# Altium schematic sheet EFR32MG24_Minimum_BOM_REF_DES_A00_SCH.SchDoc
size 420 x 297 mm; SheetNumber: 2; SheetTotal: 2
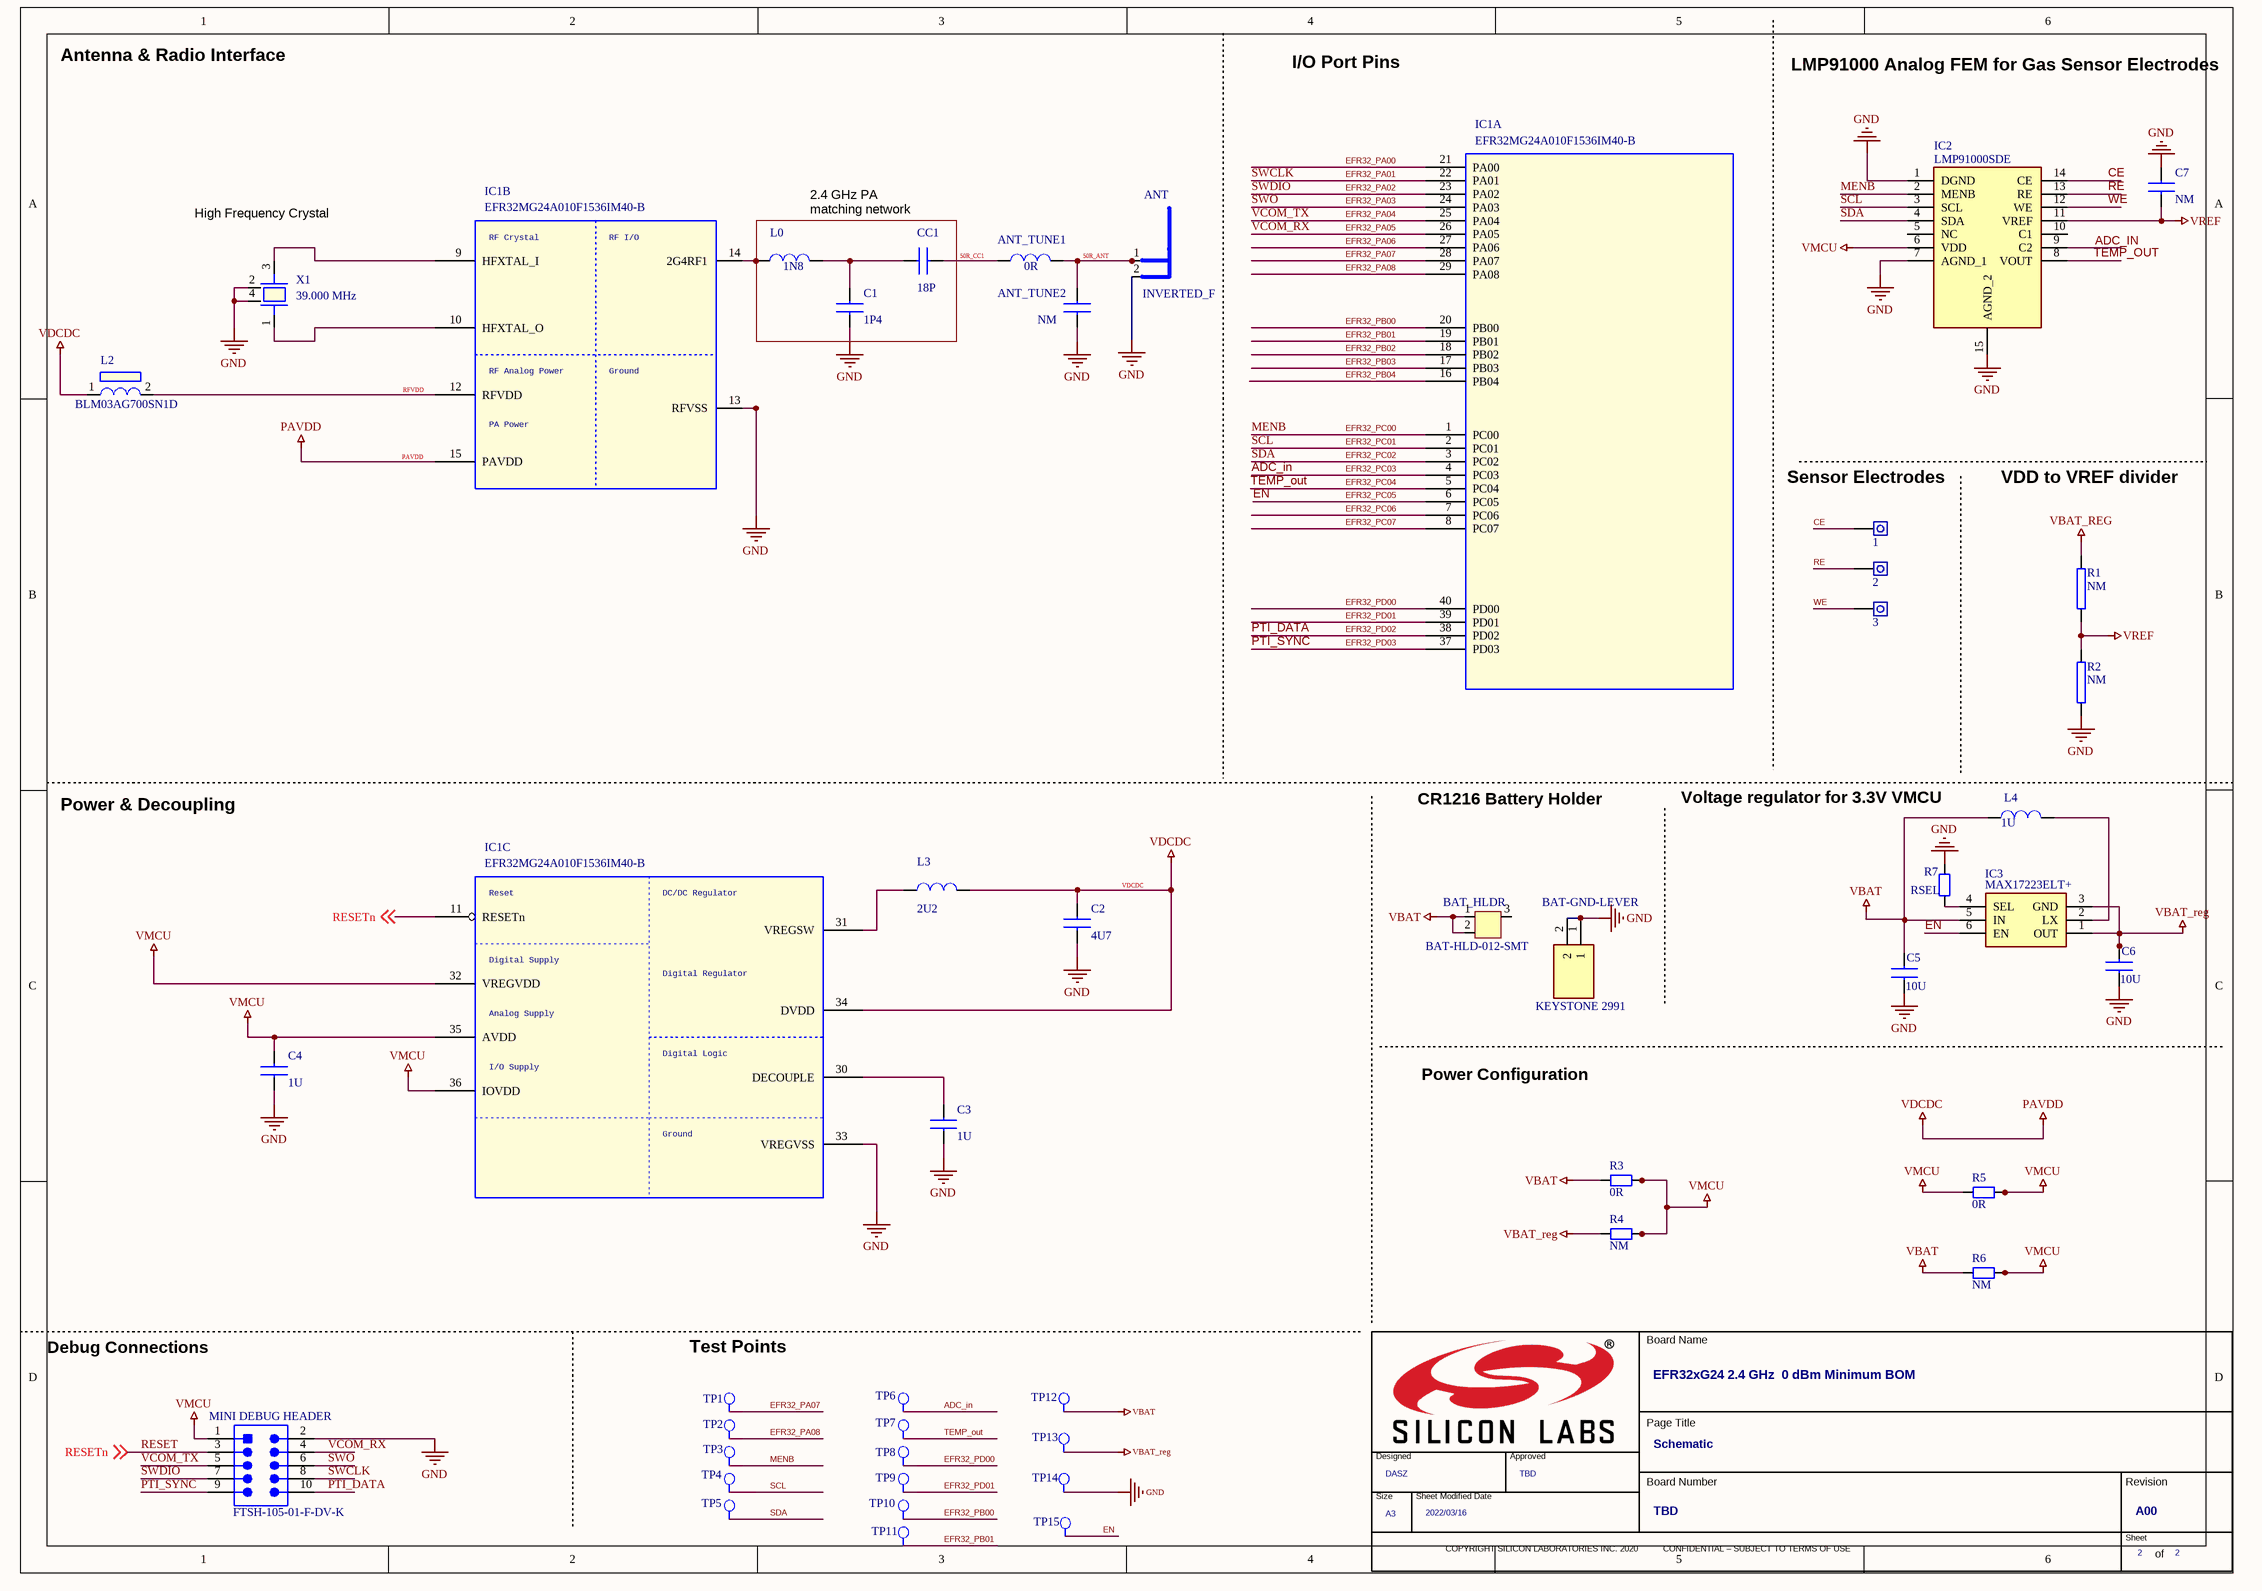
[diagram p0: EFR32MG24_Minimum_BOM_REF_DES_A00_SCH.SchDoc]

## Parts
1  Sensor Electrode  [Sensor Electrode]  (value not drawn)
2  Sensor Electrode  [Sensor Electrode]  (value not drawn)
3  Sensor Electrode  [Sensor Electrode]  (value not drawn)
*  Doc: TBD  RevCode: A00  Board Designer: DASZ  Page Title: Schematic  Page Size: A3  Page Number: 2  Title: EFR32xG24 2.4 GHz  0 dBm Minimum BOM  Page Modify Date: 2022/03/16  (hidden comment: TitleBlock_SiliconLabs_A3)  (graphical)
ANT  INVERTED_F  [ANT_MEANDERED_2445 - FABRICATION - cut]
ANT_TUNE1  0R  [COIL_0201_L]
ANT_TUNE2  NM  [C0201_L]
BAT-GND-LEVER  KEYSTONE 2991  [2991]
BAT_HLDR  BAT-HLD-012-SMT  [BATHLD012SMT]
C1  1P4  [C0201_L]
C2  4U7  [C0603_L]
C3  1U  [C0402_L]
C4  1U  [C0402_L]
C5  10U  [C0402_L]
C6  10U  [C0402_L]
C7  NM  [C0402_L]
CC1  18P  [C0201_L]
IC1  EFR32MG24A010F1536IM40-B  [QFN40_M040_5.0X5.0_EP_RP_SL]  (parts A,B,C of 3)
IC2  LMP91000SDE  [SON50P400X400X80-15N]
IC3  MAX17223ELT+  [MAX17223ELT]
L0  1N8  [COIL_0201_L]
L2  BLM03AG700SN1D  [COIL_MUR_BLM03_0201]
L3  2U2  [COIL_1008_L]
L4  1U  [C0603_L]
MINI_DEBUG_HEADER  FTSH-105-01-F-DV-K  [FTSH_105_01_L_DV_K]
R1  NM  [R0201_L]
R2  NM  [R0201_L]
R3  0R  [R0201_L]
R4  NM  [R0201_L]
R5  0R  [R0201_L]
R6  NM  [R0201_L]
R7  RSEL  [R0201_L]
TP1  TP  [TP_1.0_SMD]  (value not drawn)
TP2  TP  [TP_1.0_SMD]  (value not drawn)
TP3  TP  [TP_1.0_SMD]  (value not drawn)
TP4  TP  [TP_1.0_SMD]  (value not drawn)
TP5  TP  [TP_1.0_SMD]  (value not drawn)
TP6  TP  [TP_1.0_SMD]  (value not drawn)
TP7  TP  [TP_1.0_SMD]  (value not drawn)
TP8  TP  [TP_1.0_SMD]  (value not drawn)
TP9  TP  [TP_1.0_SMD]  (value not drawn)
TP10  TP  [TP_1.0_SMD]  (value not drawn)
TP11  TP  [TP_1.0_SMD]  (value not drawn)
TP12  TP  [TP_1.0_SMD]  (value not drawn)
TP13  TP  [TP_1.0_SMD]  (value not drawn)
TP14  TP  [TP_1.0_SMD]  (value not drawn)
TP15  TP  [TP_1.0_SMD]  (value not drawn)
X1  39.000 MHz  [X_SSS_DSX211SH_2.05X1.65-4]

## Nets
GND: ANT.2 ANT_TUNE2.2 BAT-GND-LEVER.1 BAT-GND-LEVER.2 C1.2 C2.2 C3.2 C4.2 C5.1 C6.1 C7.1 IC1.13(RFVSS) IC1.33(VREGVSS) IC2.1(DGND) IC2.7(AGND_1) IC2.15(AGND_2) MINI_DEBUG_HEADER.2 R2.1 R7.2 TP14.1(TP) X1.2 X1.4
PAVDD: C2.1 IC1.15(PAVDD) IC1.34(DVDD) L2.1 L3.2  [also labelled VDCDC]
VBAT: BAT_HLDR.1 BAT_HLDR.2 C5.2 IC3.5(IN) L4.1 R3.1 R6.1 TP12.1(TP)
VBAT_REG: C6.2 IC3.1(OUT) IC3.3(GND) R1.2 R4.1 TP13.1(TP)
VMCU: C4.1 IC1.32(VREGVDD) IC1.35(AVDD) IC1.36(IOVDD) IC2.6(VDD) MINI_DEBUG_HEADER.1 R3.2 R4.2 R5.1 R5.2 R6.2
VREF: C7.2 IC2.11(VREF) R1.1 R2.2
50R_ANT: ANT.1 ANT_TUNE1.2 ANT_TUNE2.1
50R_CC1: ANT_TUNE1.1 CC1.2
ADC_in: IC1.4(PC03) TP6.1(TP)  [also labelled EFR32_PC03]
CE: 1.1 IC2.14(CE)
EFR32_PA00: IC1.21(PA00)
EFR32_PA01: IC1.22(PA01) MINI_DEBUG_HEADER.8  [also labelled SWCLK]
EFR32_PA02: IC1.23(PA02) MINI_DEBUG_HEADER.7  [also labelled SWDIO]
EFR32_PA03: IC1.24(PA03) MINI_DEBUG_HEADER.6  [also labelled SWO]
EFR32_PA04: IC1.25(PA04) MINI_DEBUG_HEADER.5  [also labelled VCOM_TX]
EFR32_PA05: IC1.26(PA05) MINI_DEBUG_HEADER.4  [also labelled VCOM_RX]
EFR32_PA06: IC1.27(PA06)
EFR32_PA07: IC1.28(PA07) TP1.1(TP)
EFR32_PA08: IC1.29(PA08) TP2.1(TP)
EFR32_PB00: IC1.20(PB00) TP10.1(TP)
EFR32_PB01: IC1.19(PB01) TP11.1(TP)
EFR32_PB02: IC1.18(PB02)
EFR32_PB03: IC1.17(PB03)
EFR32_PB04: IC1.16(PB04)
EFR32_PC00: IC1.1(PC00) IC2.2(MENB) TP3.1(TP)  [also labelled MENB]
EFR32_PC01: IC1.2(PC01) IC2.3(SCL) TP4.1(TP)  [also labelled SCL]
EFR32_PC02: IC1.3(PC02) IC2.4(SDA) TP5.1(TP)  [also labelled SDA]
EFR32_PC04: IC1.5(PC04) IC2.8(VOUT) TP7.1(TP)  [also labelled TEMP_OUT]
EFR32_PC05: IC1.6(PC05) IC3.6(EN) TP15.1(TP)  [also labelled EN]
EFR32_PC06: IC1.7(PC06)
EFR32_PC07: IC1.8(PC07)
EFR32_PD00: IC1.40(PD00) TP8.1(TP)
EFR32_PD01: IC1.39(PD01) TP9.1(TP)
EFR32_PD02: IC1.38(PD02) MINI_DEBUG_HEADER.10  [also labelled PTI_DATA]
EFR32_PD03: IC1.37(PD03) MINI_DEBUG_HEADER.9  [also labelled PTI_SYNC]
RE: 2.1 IC2.13(RE)
RESET: IC1.11(RESETn) MINI_DEBUG_HEADER.3 ; off-sheet RESETn  [also labelled RESETn]
RFVDD: IC1.12(RFVDD) L2.2
WE: 3.1 IC2.12(WE)
NetC1_1: C1.1 CC1.1 L0.2
NetC3_1: C3.1 IC1.30(DECOUPLE)
NetIC1_9: IC1.9(HFXTAL_I) X1.3
NetIC1_10: IC1.10(HFXTAL_O) X1.1
NetIC1_14: IC1.14(2G4RF1) L0.1
NetIC1_31: IC1.31(VREGSW) L3.1
NetIC3_2: IC3.2(LX) L4.2
NetIC3_4: IC3.4(SEL) R7.1

Not connected (* = marked no-connect by the designer): BAT_HLDR 3; IC2 5(NC) 9(C2) 10(C1)

## Notes on the sheet
- Antenna & Radio Interface
- I/O Port Pins
- LMP91000 Analog FEM for Gas Sensor Electrodes
- (near X1) High Frequency Crystal
- 2.4 GHz PA
  matching network
- (near 1) Sensor Electrodes
- VDD to VREF divider
- Power & Decoupling
- CR1216 Battery Holder
- Voltage regulator for 3.3V VMCU
- Power Configuration
- Debug Connections
- Test Points
- Labels drawn without touching a wire or pin: ADC_IN
- (in symbol EFR32xG24_QFN40, part B) RF Crystal; RF I/O; RF Analog Power; Ground; PA Power
- (in symbol EFR32xG24_QFN40, part C) Reset; DC/DC Regulator; Digital Supply; Digital Regulator; Analog Supply; Digital Logic; I/O Supply; Ground
- (in symbol TitleBlock_SiliconLabs_A3) Board Name; Page Title; Designed; Approved; Board Number; Revision; Size; Sheet Modified Date; Sheet; COPYRIGHT SILICON LABORATORIES INC. 2020          CONFIDENTIAL – SUBJECT TO TERMS OF USE; of

## Library data of the parts
1-3 = Sensor Electrode: 封装: 1.2*1.2*0.6; 贴片和直插: 孔洞; 物料代码: *
ANT = INVERTED_F: PCB Footprint: EM358x_INVERTED_F
ANT_TUNE1 L0 = L0201: Mfg: Murata; Mfg #: LQP03HQ2N5B02D; Tolerance: ±0.1N; PCB Footprint: COIL_0201_L
ANT_TUNE2 C1 = C0201: Mfg #: GRM0335C1H1R6WA01D; Mfg: Murata; Tolerance: ±0.05P; Technology: C0G; PCB Footprint: C0201_L
BAT-GND-LEVER = 2991: BATTERY GND LEVER; Manufacturer_Name: Keystone Electronics; Datasheet Link: https://www.keyelco.com/product-pdf.cfm?p=3976; Height: 0.41mm; Manufacturer_Part_Number: 2991; Mouser Part Number: 534-2991; Mouser Price/Stock: https://www.mouser.co.uk/ProductDetail/Keystone-Electronics/2991?qs=BmwE3IFx0MdjpbU%252BK1etPg%3D%3D; Arrow Part Number: 2991; Arrow Price/Stock: https://www.arrow.com/en/products/2991/keystone-electronics
BAT_HLDR = BAT-HLD-012-SMT: BATTERY RETAINER COIN 12MM SMD; Manufacturer: Linx; Supplier 1: Digi-Key; Manufacturer Part Number: BAT-HLD-012-SMT; RoHS: Yes; Category: Uncategorized; Stock 1: 35581; Pricing 1: 1=0,40000, 10=0,38300, 25=0,37520, 100=0,36800, 250=0,35000, 500=0,33500, 1000=0,30100, 5000=0,24960 (USD); ComponentLink1URL: https://datasheet.ciiva.com/4/bat-hld-012-smt-4040.pdf?src-supplier=Digi-Key; ComponentLink1Description: https://datasheet.ciiva.com/4/bat-hld-012-smt-4040.pdf?src-supplier=Digi-Key; ComponentLink2URL: https://datasheet.ciiva.com/4642/bat-hld-012-smt20diagram-194862-4642562.pdf?src-supplier=Mouser; ComponentLink2Description: https://datasheet.ciiva.com/4642/bat-hld-012-smt20diagram-194862-4642562.pdf?src-supplier=Mouser; ComponentLink3URL: https://datasheet.ciiva.com/16418/bat-hld-012-smt-16418358.pdf?src-supplier=Future+Electronics; ComponentLink3Description: https://datasheet.ciiva.com/16418/bat-hld-012-smt-16418358.pdf?src-supplier=Future+Electronics
C2 = C0603: internal DC-DC output capacitor; Tolerance: 20%; Rating: 6.3V; Technology: X5R; PCB Footprint: C0603_L
C3 = C0402: DECOUPLE filtering capacitor; Tolerance: 10%; Rating: 6.3V; Technology: X7R; PCB Footprint: C0402_L
C4 = C0402: AVDD filtering capacitor; Tolerance: 10%; Rating: 6.3V; Technology: X7R; PCB Footprint: C0402_L
C5 C6 = C0201: Mfg #: GRM0335C1H1R6WA01D; Mfg: Murata; Tolerance: ±0.05P; PCB Footprint: C0201_L; Technology: C0G
C7 = C0402: Tolerance: 10%; Rating: 6.3V; Technology: X7R; PCB Footprint: C0402_L
CC1 = C0201: Mfg #: GJM0335C1E180GB01D; Mfg: Murata; Tolerance: ±2%; Technology: C0G; PCB Footprint: C0201_L
IC1 = EFR32xG24_QFN40: EFR32MG24; MFG: Silicon Labs; MFG #: EFR32MG24B210F1536IM48-BR; PCB Footprint: QFN48_M040_6.0X6.0_EP_SL
IC2 = LMP91000SDE: gas sensor; Manufacturer_Name: Texas Instruments; Datasheet Link: https://www.ti.com/lit/ds/symlink/lmp91000.pdf?ts=1600318850436&ref_url=https%253A%252F%252Fwww.ti.com%252Fstore%252Fti%252Fen%252Fp%252Fproduct%252F%253Fp%253DLMP91000SDE%252FNOPB; Height: 0.8mm; Manufacturer_Part_Number: LMP91000SDE
IC3 = MAX17223ELT+: external DC-DC Boost Converter; Manufacturer_Name: Maxim Integrated; Datasheet Link: https://componentsearchengine.com/Datasheets/1/MAX17223ELT+.pdf; Height: 0.8mm; Manufacturer_Part_Number: MAX17223ELT+; Mouser Part Number: 700-MAX17223ELT+; Mouser Price/Stock: https://www.mouser.co.uk/ProductDetail/Maxim-Integrated/MAX17223ELT%2b?qs=xhbEVWpZdWfeoUoo5CwP2w%3D%3D
L2 = BLM03AX: RFVDD ferrite; Mfg: Murata; Mfg #: BLM03AG700SN1D; Price_1K: 0.05; PCB Footprint: COIL_MUR_BLM03_0201
L3 = L1008: internal DC-DC output inductor; Tolerance: +/-20%; Mfg #: DFE2HCAH2R2MJ0L; Mfg: Murata; PCB Footprint: COIL_1008_L
L4 = L1008: Tolerance: +/-20%; Mfg #: DFE2HCAH2R2MJ0L; Mfg: Murata; PCB Footprint: COIL_1008_L
MINI_DEBUG_HEADER = CN-2P-M-R10: Male Header, Pitch 1.27 mm, 2 x 5 Position, Height 6.12 mm, RoHS, Tube; Manufacturer: Samtec; Number of Positions: 10; Connector Type: Header,Shrouded; Number of Positions Loaded: All; Row Spacing: 0.050"(1.27mm); Fastening Type: -; Package Reference: FTSH-105-01-L-DV-K; Termination: Solder; Package URL: http://suddendocs.samtec.com/prints/ftsh-1xx-xx-xxx-dv-xxx-footprint.pdf; Number of Rows: 2; Contact Finish Thickness: 3µin(0.08µm); Contact Type: MalePin; Manufacturer URL: http://www.samtec.com/; Contact Mating Length: 0.120"(3.05mm); Pitch: 0.050"(1.27mm); Series: FTSH; Features: -; Contact Finish: Gold; Color: Black; Family: RectangularConnectors-Headers,MalePins; Datasheet URL: http://suddendocs.samtec.com/prints/ftsh-1xx-xx-xxx-dv-xxx-mkt.pdf; Package Description: Male Header, Pitch 1.27 mm, 2 x 5 Position, Height 5.97 mm, Tail Length 4.32 mm; Mounting Type: SurfaceMount; Datasheet Version: Rev. ET, 10/1995; Category: Connectors,Interconnects; Packaging: Tube
R1 R2 = Resistor: 100K,±0.1%,0402; 物料代码: 8.02.17.1406; 名称: 电阻; 封装: 0402R; 设备封装名称: R0402_100K; 厂商: Yageo; 贴片和直插: SMT; 型号: 100K,±0.1%; Value: NM
R3-R7 = R0201_0R
TP1-TP15 = TPJ_SMD_Dup1: PCB Footprint: TP_1.0_SMD
X1 = DSX211SH: 39 MHZ HFXO; Mfg #: 8Y39072002; Mfg: TXC; PCB Footprint: KDS_DSX211SH_2016; Price_1K: 0.512
* = TitleBlock_SiliconLabs_A3: Board Approver: TBD; Page Count: 2; OrgName: Silicon Labs